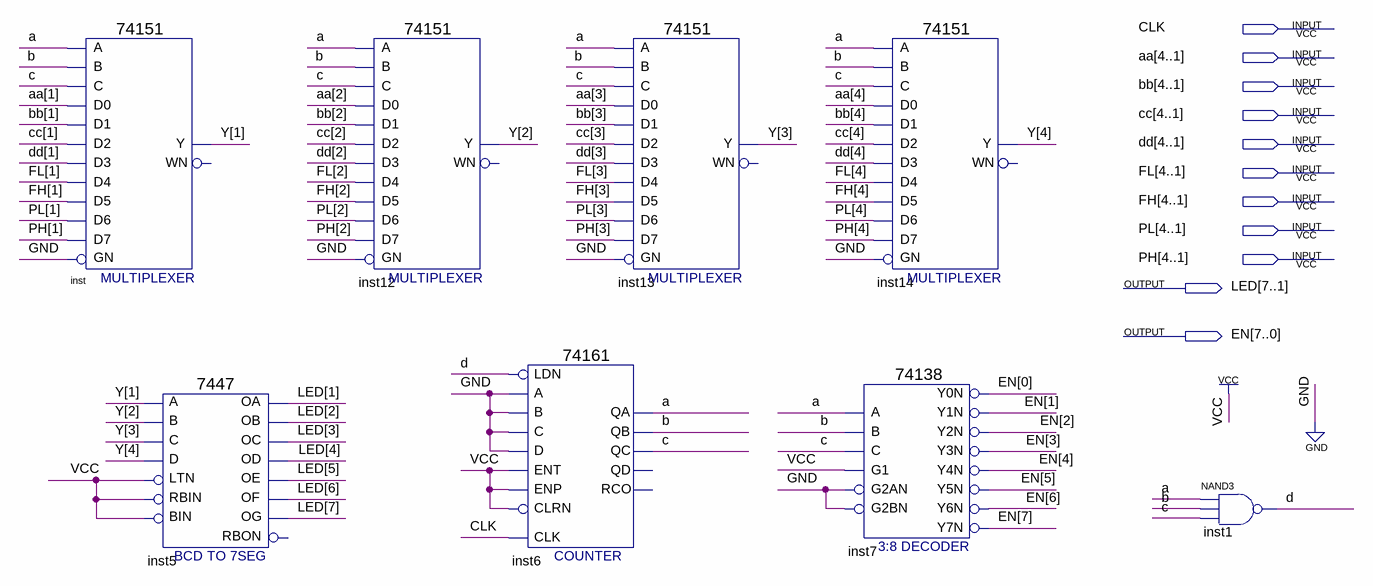
[diagram p0: schematic sheet]
// Quartus schematic DECORADE.bdf as structural Verilog: 8 symbols, 11 pins
module DECORADE (
  input  CLK,
  input  [4:1] aa,
  input  [4:1] bb,
  input  [4:1] cc,
  input  [4:1] dd,
  input  [4:1] FL,
  input  [4:1] FH,
  input  [4:1] PL,
  input  [4:1] PH,
  output [7:1] LED,
  output [7:0] EN
);

  wire a, b, c, d;
  wire [4:1] Y;

  \74151  inst (
    .GN(1'b0), .C(c), .B(b), .A(a), .D5(FH[1]), .D0(aa[1]), .D1(bb[1]), .D4(FL[1]), .D3(dd[1]), .D2(cc[1]),
    .D6(PL[1]), .D7(PH[1]), .Y(Y[1]));  // open: WN
  \7447  inst5 (
    .LTN(1'b1), .B(Y[2]), .C(Y[3]), .D(Y[4]), .RBIN(1'b1), .BIN(1'b1), .A(Y[1]), .OB(LED[2]), .OC(LED[3]),
    .OE(LED[5]), .OD(LED[4]), .OF(LED[6]), .OG(LED[7]), .OA(LED[1]));  // open: RBON
  \74151  inst12 (
    .GN(1'b0), .C(c), .B(b), .A(a), .D5(FH[2]), .D0(aa[2]), .D1(bb[2]), .D4(FL[2]), .D3(dd[2]), .D2(cc[2]),
    .D6(PL[2]), .D7(PH[2]), .Y(Y[2]));  // open: WN
  \74161  inst6 (
    .CLRN(1'b1), .CLK(CLK), .ENP(1'b1), .LDN(d), .A(1'b0), .D(1'b0), .ENT(1'b1), .B(1'b0), .C(1'b0), .QC(c),
    .QB(b), .QA(a));  // open: QD, RCO
  \74151  inst13 (
    .GN(1'b0), .C(c), .B(b), .A(a), .D5(FH[3]), .D0(aa[3]), .D1(bb[3]), .D4(FL[3]), .D3(dd[3]), .D2(cc[3]),
    .D6(PL[3]), .D7(PH[3]), .Y(Y[3]));  // open: WN
  \74138  inst7 (
    .A(a), .B(b), .G1(1'b1), .C(c), .G2AN(1'b0), .G2BN(1'b0), .Y0N(EN[0]), .Y1N(EN[1]), .Y2N(EN[2]),
    .Y3N(EN[3]), .Y4N(EN[4]), .Y5N(EN[5]), .Y6N(EN[6]), .Y7N(EN[7]));
  \74151  inst14 (
    .GN(1'b0), .C(c), .B(b), .A(a), .D5(FH[4]), .D0(aa[4]), .D1(bb[4]), .D4(FL[4]), .D3(dd[4]), .D2(cc[4]),
    .D6(PL[4]), .D7(PH[4]), .Y(Y[4]));  // open: WN
  nand inst1 (d, a, b, c);
endmodule
